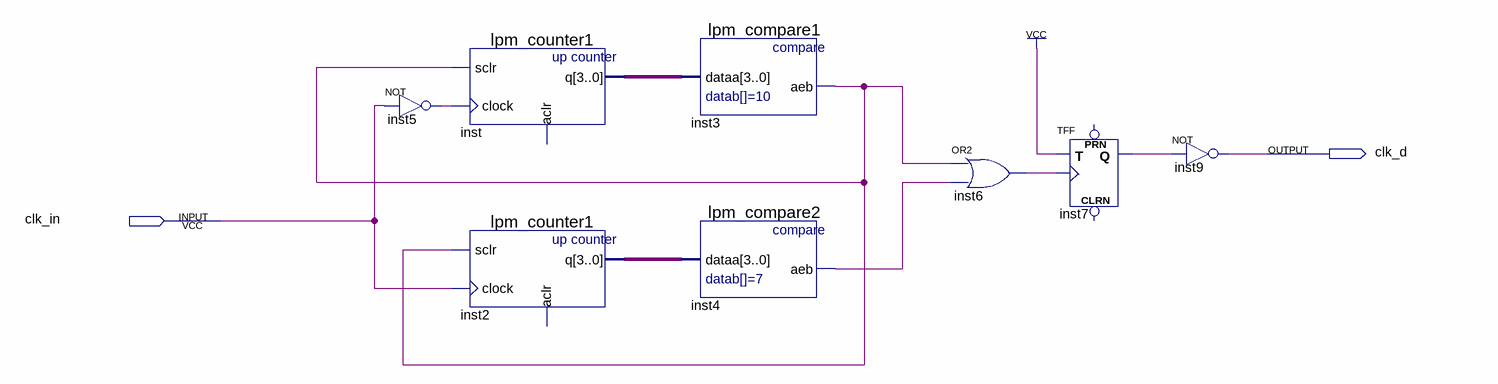
[diagram p0: schematic sheet]
// Quartus schematic Block2.bdf as structural Verilog: 8 symbols, 2 pins
module Block2 (
  input  clk_in,
  output clk_d
);

  wire inst3_aeb, inst4_aeb, inst5_out, inst6_out, inst7_q;
  wire [3:0] inst2_q, inst_q;

  not inst5 (inst5_out, clk_in);
  lpm_counter1 inst (.sclr(inst3_aeb), .clock(inst5_out), .q(inst_q));  // open: aclr
  lpm_counter1 inst2 (.sclr(inst3_aeb), .clock(clk_in), .q(inst2_q));  // open: aclr
  lpm_compare1 inst3 (.dataa(inst_q), .aeb(inst3_aeb));
  lpm_compare2 inst4 (.dataa(inst2_q), .aeb(inst4_aeb));
  or inst6 (inst6_out, inst3_aeb, inst4_aeb);
  TFF inst7 (.T(1'b1), .CLK(inst6_out), .Q(inst7_q));  // open: PRN, CLRN
  not inst9 (clk_d, inst7_q);
endmodule
